# Altium schematic sheet Peripheral.SchDoc
size 420 x 297 mm; Scale: 1:1; DocumentType: Схема электрическая принципиальная; SheetNumber: 32; SheetTotal: 32; DocumentTypeShort: Э3; DocumentInvertoryNumber: ㅤ
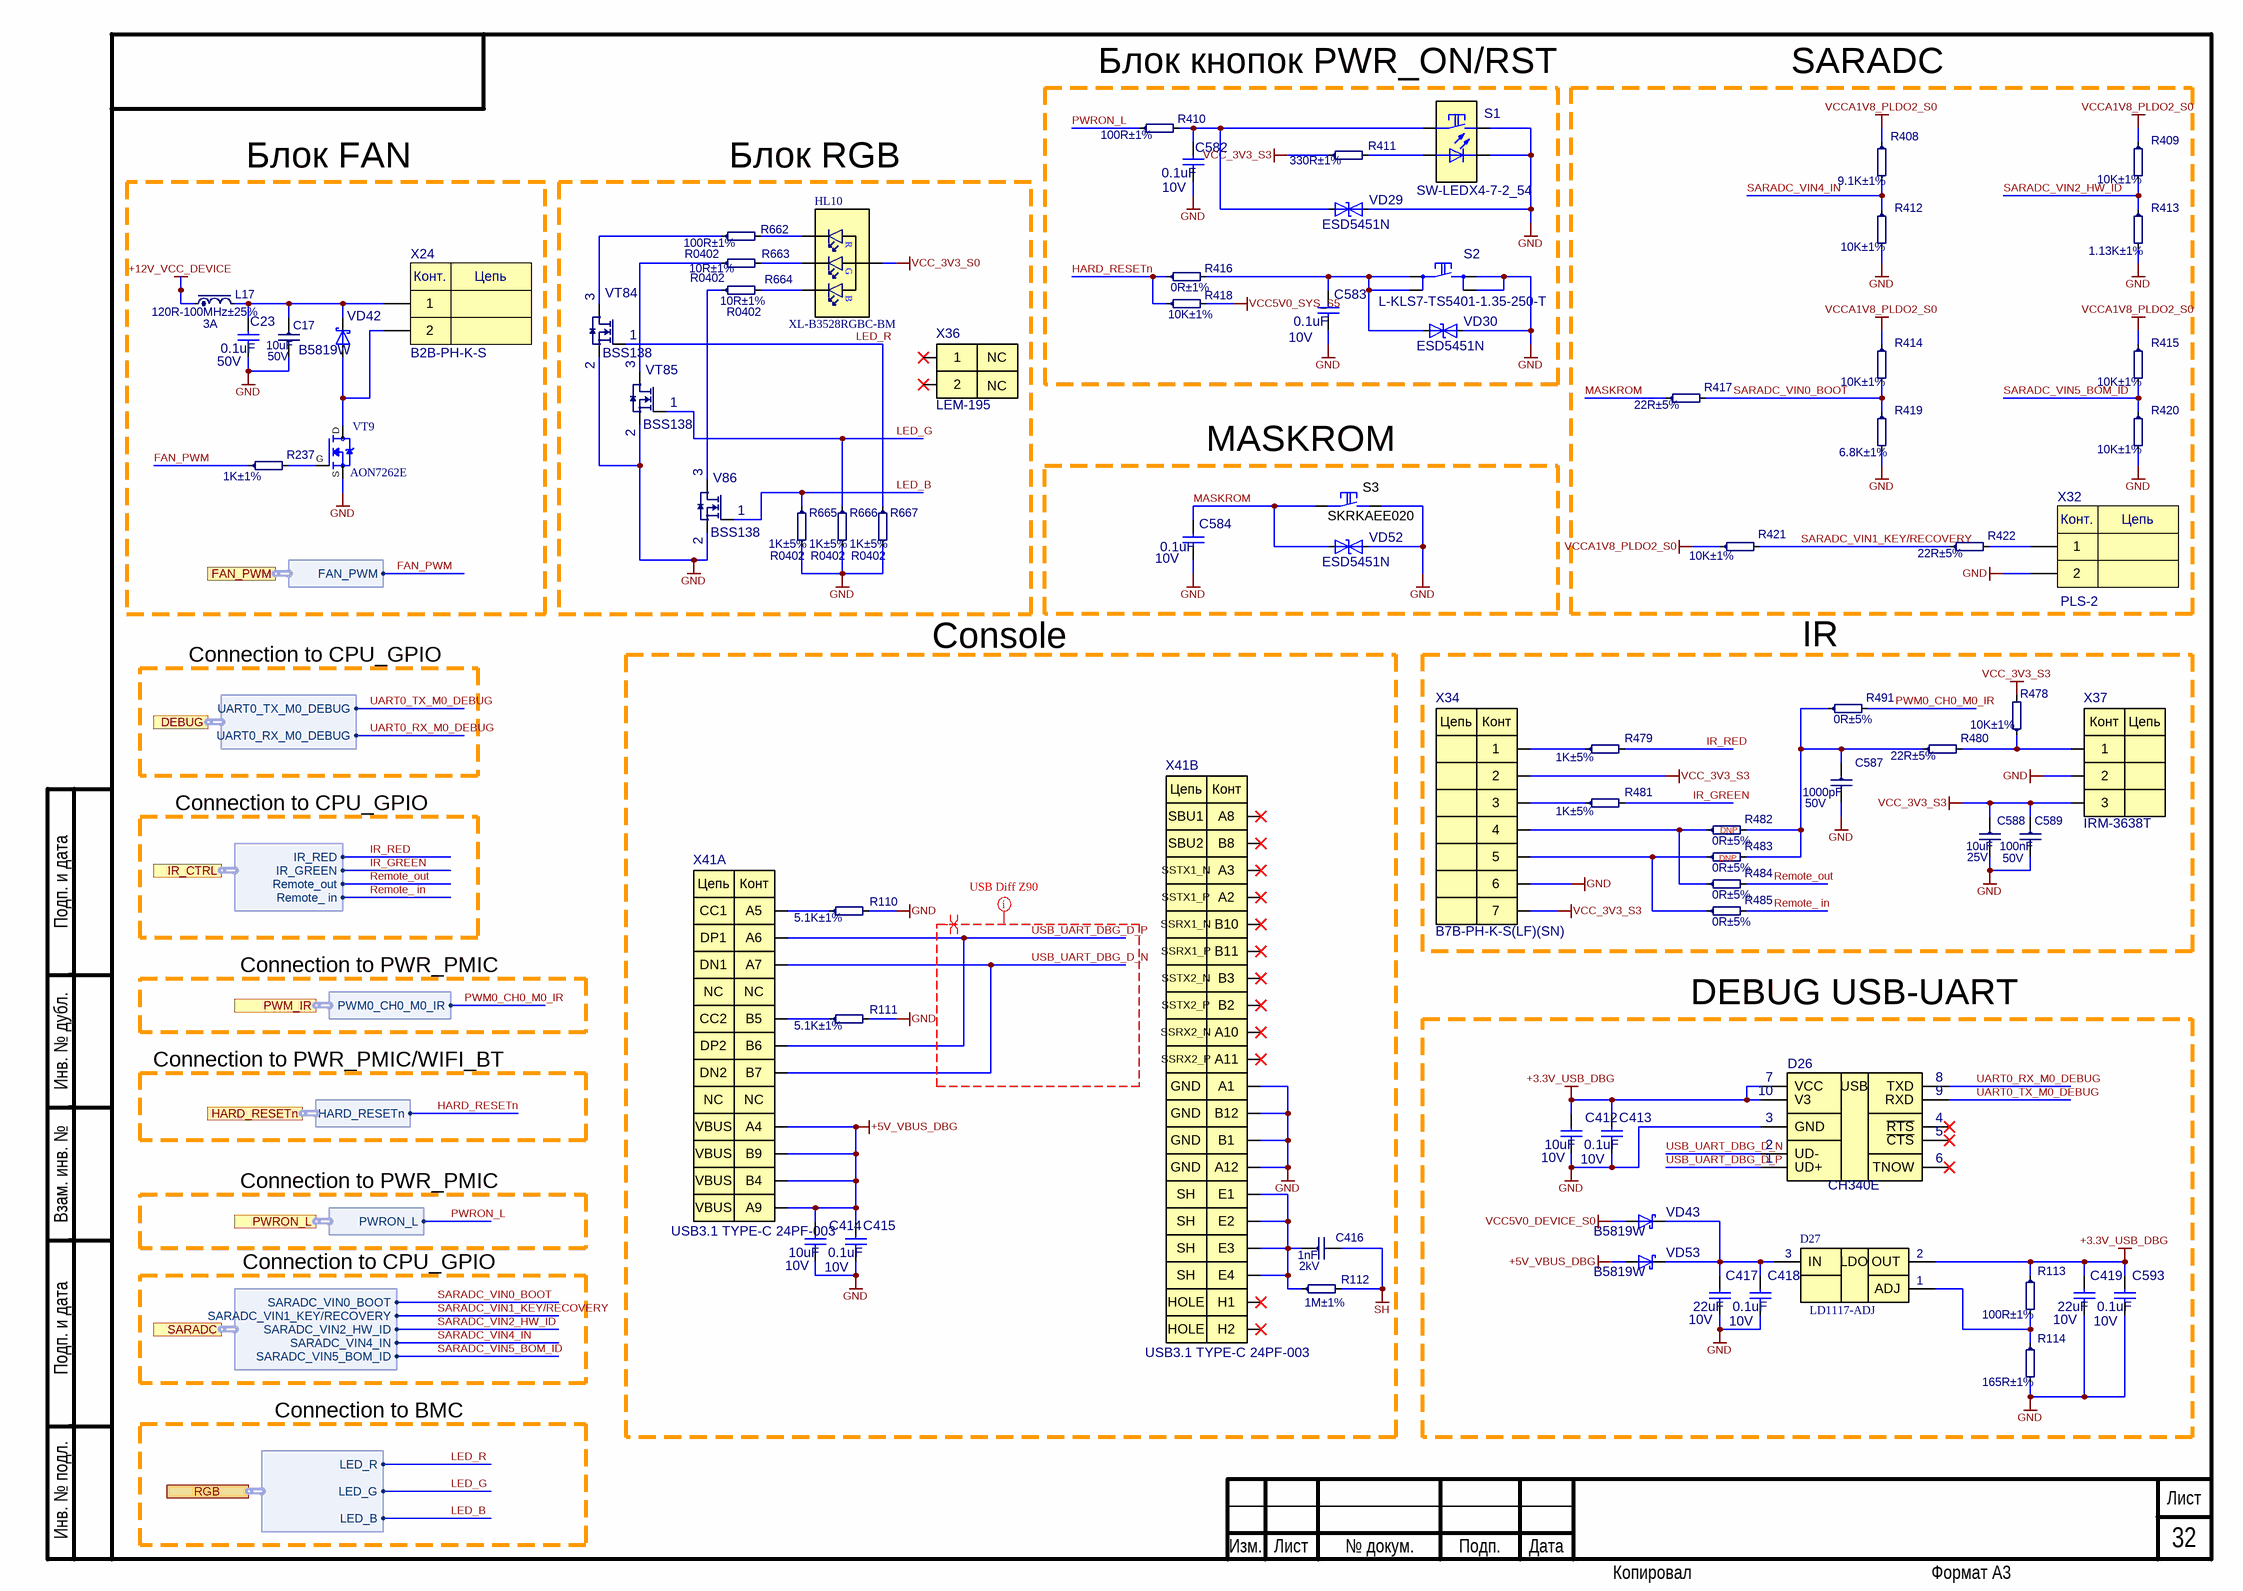
[diagram p0: Peripheral.SchDoc]

## Parts
C17  10uF  Voltage: 50V  [C1206]
C23  0.1uF  Voltage: 50V  [C0402]
C412  10uF  Voltage: 10V  [C0402]
C413  0.1uF  Voltage: 10V  [C0402]
C414  10uF  Voltage: 10V  [C0402]
C415  0.1uF  Voltage: 10V  [C0402]
C416  1nF  Voltage: 2kV  [C1812]
C417  22uF  Voltage: 10V  [C0603]
C418  0.1uF  Voltage: 10V  [C0402]
C419  22uF  Voltage: 10V  [C0603]
C582  0.1uF  Voltage: 10V  [C0402]
C583  0.1uF  Voltage: 10V  [C0402]
C584  0.1uF  Voltage: 10V  [C0402]
C587  1000pF  Voltage: 50V  [C0402]
C588  10uF  Voltage: 25V  [C0805]
C589  100nF  Voltage: 50V  [C0402]
C593  0.1uF  Voltage: 10V  [C0402]
D26  CH340E  [MSOP-10]
D27  LD1117-ADJ  [GM1117S-AST3R]
HL10  XL-B3528RGBC-BM  [XL-B3528RGBC-BM]
L17  120R-100MHz±25%  Current: 3A  [L0805]
R110  5.1K±1%  [R0402]
R111  5.1K±1%  [R0402]
R112  1M±1%  [R1206]
R113  100R±1%  [R0402]
R114  165R±1%  [R0402]
R237  1K±1%  [R0402]
R408  9.1K±1%  [R0402]
R409  10K±1%  [R0402]
R410  100R±1%  [R0402]
R411  330R±1%  [R0402]
R412  10K±1%  [R0402]
R413  1.13K±1%  [R0402]
R414  10K±1%  [R0402]
R415  10K±1%  [R0402]
R416  0R±1%  [R0402]
R417  22R±5%  [R0402]
R418  10K±1%  [R0402]
R419  6.8K±1%  [R0402]
R420  10K±1%  [R0402]
R421  10K±1%  [R0402]
R422  22R±5%  [R0402]
R478  10K±1%  [R0402]
R479  1K±5%  [R0402]
R480  22R±5%  [R0402]
R481  1K±5%  [R0402]
R482  0R±5%  [R0402]
R483  0R±5%  [R0402]
R484  0R±5%  [R0402]
R485  0R±5%  [R0402]
R491  0R±5%  [R0402]
R662  100R±1%  [R0402]
R663  10R±1%  [R0402]
R664  10R±1%  [R0402]
R665  1K±5%  [R0402]
R666  1K±5%  [R0402]
R667  1K±5%  [R0402]
S1  SW-LEDX4-7-2_54  [SW-LEDX4-7-2_54]
S2  L-KLS7-TS5401-1.35-250-T  [KLS7-TS5401]
S3  SKRKAEE020  [SKRKAEE020]
V86  BSS138  [SOT23]
VD29  ESD5451N  [DFN_1006_2]
VD30  ESD5451N  [DFN_1006_2]
VD42  B5819W  [B5819W]
VD43  B5819W  [B5819W]
VD52  ESD5451N  [DFN_1006_2]
VD53  B5819W  [B5819W]
VT9  AON7262E  [AON7262E]
VT84  BSS138  [SOT23]
VT85  BSS138  [SOT23]
X24  B2B-PH-K-S  [B2B-PH-K-S]
X32  PLS-2  [PLS2]
X34  B7B-PH-K-S(LF)(SN)  [B7B-PH-K-S(LF)(SN)]
X36  LEM-195  [LEM-195]
X37  IRM-3638T  [IRM-3638T]
X41  USB3.1 TYPE-C 24PF-003  [USB3.1 TYPE-C 24PF-003]  (parts A,B of 2)

## Blocks framed on the sheet
Console: C414-C416 R110-R112 X41

## Ports
DEBUG (harness DEBUG), FAN_PWM (harness FAN_PWM), HARD_RESETn (harness HARD_RESETn), IR_CTRL (harness IR_CTRL), PWM_IR (harness PWM0_IR), PWRON_L (harness PWRON_L), RGB (harness RGB), SARADC (harness SARADC)

## Harnesses
RGB: LED_G, LED_R, LED_B
PWRON_L: PWRON_L
SARADC: SARADC_VIN4_IN, SARADC_VIN2_HW_ID, SARADC_VIN1_KEY/RECOVERY, SARADC_VIN0_BOOT, SARADC_VIN5_BOM_ID
HARD_RESETn: HARD_RESETn
IR_CTRL: Remote_out, IR_GREEN, IR_RED, Remote_ in
PWM0_IR: PWM0_CH0_M0_IR
DEBUG: UART0_RX_M0_DEBUG, UART0_TX_M0_DEBUG
FAN_PWM: FAN_PWM

## Nets
+3.3V_USB_DBG: C412.2 C413.2 C419.2 C593.2 D26.7(VCC) D26.10(V3) D27.2(OUT) R113.1
+5V_VBUS_DBG: C414.2 C415.2 VD53.2(A) X41.A4(VBUS) X41.A9(VBUS) X41.B4(VBUS) X41.B9(VBUS)
+12V_VCC_DEVICE: L17.1
GND: C17.2 C23.1 C412.1 C413.1 C414.1 C415.1 C417.1 C418.1 C419.1 C582.1 C583.1 C584.1 C587.2 C588.2 C589.2 C593.1 D26.3(GND) R110.2 R111.2 R114.2 R412.2 R413.2 R419.2 R420.2 R665.2 R666.2 R667.2 S1.2 S1.L2(C) S2.3 S2.4 S3.2 V86.2(S) VD29.1 VD30.1 VD52.1 VT9.S VT84.2(S) VT85.2(S) X32.2 X34.6 X37.2 X41.A12(GND) X41.B1(GND) X41.B12(GND)
SH: C416.2 R112.2
VCC5V0_DEVICE_S0: VD43.2(A)
VCC5V0_SYS_S5: R418.2
VCC_3V3_S0: HL10.2
VCC_3V3_S3: C588.1 C589.1 R411.1 R478.2 X34.2 X34.7 X37.3
VCCA1V8_PLDO2_S0: R408.1 R409.1 R414.1 R415.1 R421.1
FAN_PWM: R237.1 ; port FAN_PWM.FAN_PWM
HARD_RESETn: R416.1 R418.1 ; port HARD_RESETn.HARD_RESETn
IR_GREEN: R481.2 ; port IR_CTRL.IR_GREEN
IR_RED: R479.2 ; port IR_CTRL.IR_RED
LED_B: R665.1 V86.1(G) ; port RGB.LED_B
LED_G: R666.1 VT85.1(G) ; port RGB.LED_G
LED_R: R667.1 VT84.1(G) ; port RGB.LED_R
MASKROM: C584.2 R417.1 S3.1 VD52.2
PWM0_CH0_M0_IR: R491.2 ; port PWM_IR.PWM0_CH0_M0_IR
PWRON_L: R410.1 ; port PWRON_L.PWRON_L
Remote_ in: R485.2 ; port IR_CTRL.Remote_ in
Remote_out: R484.2 ; port IR_CTRL.Remote_out
SARADC_VIN0_BOOT: R414.2 R417.2 R419.1 ; port SARADC.SARADC_VIN0_BOOT
SARADC_VIN1_KEY/RECOVERY: R421.2 R422.1 ; port SARADC.SARADC_VIN1_KEY/RECOVERY
SARADC_VIN2_HW_ID: R409.2 R413.1 ; port SARADC.SARADC_VIN2_HW_ID
SARADC_VIN4_IN: R408.2 R412.1 ; port SARADC.SARADC_VIN4_IN
SARADC_VIN5_BOM_ID: R415.2 R420.1 ; port SARADC.SARADC_VIN5_BOM_ID
UART0_RX_M0_DEBUG: D26.8(TXD) ; port DEBUG.UART0_RX_M0_DEBUG
UART0_TX_M0_DEBUG: D26.9(RXD) ; port DEBUG.UART0_TX_M0_DEBUG
USB_UART_DBG_D_N: D26.2(UD-) X41.A7(DN1) X41.B7(DN2)
USB_UART_DBG_D_P: D26.1(UD+) X41.A6(DP1) X41.B6(DP2)
NetC17_1: C17.1 C23.2 L17.2 VD42.1(K) X24.1
NetC416_1: C416.1 R112.1 X41.E1(SH) X41.E2(SH) X41.E3(SH) X41.E4(SH)
NetC417_2: C417.2 C418.2 D27.3(IN) VD43.1(K) VD53.1(K)
NetC582_2: C582.2 R410.2 S1.1 VD29.2
NetC583_2: C583.2 R416.2 S2.1 S2.2 VD30.2
NetC587_1: C587.1 R480.1 R482.2 R483.2 R491.1
NetD27_1: D27.1(ADJ) R113.2 R114.1
NetHL10_1: HL10.1 R662.2
NetHL10_3: HL10.3 R663.2
NetHL10_4: HL10.4 R664.2
NetR110_1: R110.1 X41.A5(CC1)
NetR111_1: R111.1 X41.B5(CC2)
NetR237_2: R237.2 VT9.G
NetR411_2: R411.2 S1.L1(A)
NetR422_2: R422.2 X32.1
NetR478_1: R478.1 R480.2 X37.1
NetR479_1: R479.1 X34.1
NetR481_1: R481.1 X34.3
NetR482_1: R482.1 R484.1 X34.4
NetR483_1: R483.1 R485.1 X34.5
NetR662_1: R662.1 VT84.3(D)
NetR663_1: R663.1 VT85.3(D)
NetR664_1: R664.1 V86.3(D)
NetVD42_2: VD42.2(A) VT9.D X24.2

Not connected (* = marked no-connect by the designer): D26 4(~{RTS})* 5(~{CTS})* 6(TNOW)*; X36 1* 2*; X41 A2(SSTX1_P)* A3(SSTX1_N)* A8(SBU1)* A10(SSRX2_N)* A11(SSRX2_P)* B2(SSTX2_P)* B3(SSTX2_N)* B8(SBU2)* B10(SSRX1_N)* B11(SSRX1_P)* H1(GND)* H2(GND)*

## Layout directives
net class USB: USB_UART_DBG_D_N, USB_UART_DBG_D_P
differential pair; differential pair class Diff_Z90: USB_UART_DBG_D_N, USB_UART_DBG_D_P

## Notes on the sheet
- Блок кнопок PWR_ON/RST
- SARADC
- Блок FAN
- Блок RGB
- (near S3) MASKROM
- Connection to CPU_GPIO
- IR
- (near R483) DNP
- (near R482) DNP
- Connection to PWR_PMIC
- DEBUG USB-UART
- Connection to PWR_PMIC/WIFI_BT
- Connection to BMC
- Подп. и дата
- Инв. № дубл.
- Взам. инв. №
- Инв. № подл.
- Изм.
- Лист
- № докум.
- Подп.
- Дата
- Копировал
- Формат А3
- (in symbol B2B-PH-K-S) Конт.; Цепь
- (in symbol B7B-PH-K-S(LF)(SN)) Цепь; Конт
- (in symbol CH340E) USB
- (in symbol GM1117S-AST3R) LDO
- (in symbol IRM-3638T) Конт; Цепь
- (in symbol LEM-195) NC
- (in symbol PLS-2) Конт.; Цепь
- (in symbol USB3.1 TYPE-C 24PF-003, part A) Цепь; Конт; NC
- (in symbol USB3.1 TYPE-C 24PF-003, part B) Цепь; Конт; A1; HOLE
- (in symbol XL-B3528RGBC-BM) R; G; B

## Library data of the parts
C17 = 1206-X5R-50V-010uF±10%: Manufacturer: Yageo; NameFromManufacturer: CC1206KKX5R9BB106; Dielectric: X5R; Place: *); Tolerance: 10%; Check: False; Case: C1206; Part Number: 1206-X5R-50V-010uF±10%; Value: 10uF; Temperature: -55°C~85°C; ComponentLink2Description: Link to datasheet; ComponentLink1Description: DATASHEET; ComponentLink2URL: https://www.terraelectronica.ru/product/2097656; ComponentLink1URL: Datasheets/capacitors/UPY-GPHC_X5R_4V-to-50V_27.pdf; Last changed: 27.10.2022
C23 = 0402-X5R-50V-0.1uF±10%: Manufacturer: Yageo; NameFromManufacturer: CC0402KRX5R9BB104; Place: S; Tolerance: 10%; Check: False; Part Number: 0402-X5R-50V-0.1uF±10%; Value: 0.1uF; Temperature: -55°C~85°C; ComponentLink2Description: Link to datasheet; ComponentLink1Description: DATASHEET; ComponentLink2URL: https://www.yageo.com/upload/media/product/productsearch/datasheet/mlcc/UPY-GPHC_X5R_4V-to-50V_26.pdf; ComponentLink1URL: Datasheets/capacitors/UPY-GPHC_X5R_4V-to-50V_26.pdf; Last changed: 27.10.2022
C412 C414 = 0402-X5R-10V-10uF±20%: *; Manufacturer: Murata Electronics; NameFromManufacturer: GRM155R61A106ME44; Place: S; Tolerance: 20%; Check: False; Part Number: 0402-X5R-10V-10uF±20%; Value: 10uF; Temperature: -55°C~85°C; ComponentLink2Description: Link to datasheet; ComponentLink1Description: DATASHEET; ComponentLink2URL: https://octopart.com/grm155r61a106me44d-murata-99357754?r=sp; ComponentLink1URL: Datasheets/capacitors/GRM155R61A106ME44D.pdf; Last changed: 27.10.2022
C413 C415 C418 C582-C584 C593 = 0402-X7R-16V-0.1uF±10%: Part Number: 0402-X5R-10V-0.1uF±10%; Manufacturer: Yageo; NameFromManufacturer: CC0402KRX5R6BB104; Place: S; Tolerance: 10%; Check: False; Value: 0.1uF; Temperature: -55°C~125°C; ComponentLink2Description: Link to datasheet; ComponentLink1Description: DATASHEET; Last changed: 27.10.2022
C416 = 1812-C0G-2kV-1uF±10%: *; Part Number: 1812-C0G-2kV-1nF±10%; Manufacturer: FH; NameFromManufacturer: 1812B102K202NT; Dielectric: C0G; Place: *); Tolerance: 5%; Check: False; Case: CASE; Value: 1nF; Temperature: -55°C~125°C; ComponentLink2Description: Link to datasheet; ComponentLink1Description: DATASHEET; ComponentLink2URL: https://octopart.com/1812ga102jat2a-avx-75165070?r=sp; ComponentLink1URL: Datasheets/capacitors/C0GNP0-Dielectric.pdf; Last changed: 27.10.2022
C417 C419 = 0603-X5R-10V-22uF±20%: *; Manufacturer: Murata; NameFromManufacturer: GRM188R61A226ME15D; Place: S; Tolerance: 20%; Part Number: 0603-X5R-10V-22uF±20%; Value: 22uF; Temperature: -55°C~85°C; ComponentLink2Description: Link to datasheet; ComponentLink1Description: DATASHEET
C587 = 0402-NP0-50V-1000pF±5%: Manufacturer: Yageo; NameFromManufacturer: CC0402JRNPO9BN102; Dielectric: NP0; Place: *); Tolerance: 5%; Check: False; Case: C0402; Part Number: 0402-NP0-50V-1000pF±5%; Value: 1000pF; Temperature: -55°C~125°C; ComponentLink2Description: Link to datasheet; ComponentLink1Description: DATASHEET; ComponentLink2URL: https://www.terraelectronica.ru/product/2101763; ComponentLink1URL: Datasheets/capacitors/UPY-GP_NP0_16V-to-50V_18.pdf; Last changed: 27.10.2022
C588 = 0805-X5R-25V-10uF±10%: Manufacturer: Samsung; NameFromManufacturer: CL21A106KAYNNNE; Dielectric: X5R; Place: *); Tolerance: 10%; Check: False; Case: C0805; Part Number: 0805-X5R-25V-10uF±10%; Value: 10uF; Temperature: -55°C~85°C; ComponentLink2Description: Link to datasheet; ComponentLink1Description: DATASHEET; ComponentLink2URL: https://www.terraelectronica.ru/product/1640984; ComponentLink1URL: Datasheets/capacitors/MLCC-1837944.pdf; Last changed: 27.10.2022
C589 = 0402-X7R-50V-0.1uF±10%: Ceramic Capacitor 0402 100nF ±10% 50V X7R; Manufacturer: Yageo; NameFromManufacturer: CC0402KRX7R9BB104; Place: *); Check: False; Dielectric: X7R; Case: C0402; Part Number: 0402-X7R-50V-0.1uF±10%; Value: 100nF; Tolerance: 10%; Temperature: -55°C~125°C; ComponentLink2Description: Link to datasheet; ComponentLink1Description: DATASHEET; ComponentLink2URL: https://www.lcsc.com/product-detail/Multilayer-Ceramic-Capacitors-MLCC-SMD-SMT_YAGEO-CC0402KRX7R9BB104_C131394.html; Last changed: 09.04.2025
D26 = CH340E: USB to serial chip; Manufacturer: WCH; Place: S; Check: False; Part Number: CH340E; Value: CH340E; ComponentLink1Description: DATASHEET; NameFromManufacturer: CH340E; Datasheet: Datasheets/ic/35227cpdata.pdf; Last changed: 27.10.2022
D27 = GM1117S-AST3R: Manufacturer: UMW; Check: False; Part Number: LD1117-ADJ; NameFromManufacturer: LD1117-ADJ; Value: LD1117-ADJ; Analog: GM1117S-AST3R
HL10 = XL-B3528RGBC-BM: 20mA 无色透明透镜 -40℃~+85℃ Common anode 正贴 RGB 45mW SMD2835-4P Light Emitting Diodes (LED) ROHS; Manufacturer: XINGLIGHT; Check: False; Part Number: XL-B3528RGBC-BM; NameFromManufacturer: XL-B3528RGBC-BM; Value: XL-B3528RGBC-BM
L17 = 0805-3A-120R-100MHz: *; Manufacturer: Murata Electronics; NameFromManufacturer: BLM21PG121SH1D; Place: *); Tolerance: 25%; DC Resistance: 0.03R; Check: False; Case: L0805; Part Number: 0805-3A-120R-100MHz; Value: 120R-100MHz; Temperature: -55°C~125°C; ComponentLink1Description: DATASHEET; ComponentLink1URL: https://www.terraelectronica.ru/product/854541; Datasheet: Datasheets/inductors/QNFA9102.pdf; Last changed: 27.10.2022
R110 R111 = 0402-0.0625W-5.1K-100ppm±1%: Chip Resistor 0402 5.1kΩ ±1% 50V ±100ppm/℃ Thick Film; NameFromManufacturer: RC0402FR-075K1L; Manufacturer: Yageo; Place: *); Value: 5.1K; Check: False; Case: R0402; Part Number: 0402-0.0625W-5.1K-100ppm±1%; Tolerance: 1%; Temperature: -55°C~155°C; ComponentLink1Description: DATASHEET; ComponentLink1URL: https://www.yageo.com/upload/media/product/productsearch/datasheet/rchip/PYu-RC_Group_51_RoHS_L_11.pdf; Datasheet: Datasheets/resistors/PYu-RC_Group_51_RoHS_L_11.pdf; Last changed: 27.10.2022
R112 = 1206-0.25W-1M-100ppm±1%: Chip Resistor 1206 1MΩ ±1% 200V ±100ppm/℃ Thick Film; NameFromManufacturer: RC1206FR-071ML; Manufacturer: Yageo; Place: *); Value: 1M; Check: False; Case: R1206; Part Number: 1206-0.25W-1M-100ppm±1%; Tolerance: 1%; Temperature: -55°C~155°C; ComponentLink1Description: DATASHEET; ComponentLink1URL: https://www.lcsc.com/product-detail/Chip-Resistor-Surface-Mount_YAGEO-RC1206FR-071ML_C108083.html?s_z=n_RC1206FR-071ML; Last changed: 09.04.2025
R113 R410 R662 = 0402-0.0625W-100R-100ppm±1%: Chip Resistor 0402 100Ω ±1% 50V ±100ppm/℃ Thick Film; NameFromManufacturer: RC0402FR-07100RL; Manufacturer: Yageo; Place: *); Value: 100R; Check: False; Case: R0402; Part Number: 0402-0.0625W-100R-100ppm±1%; Tolerance: 1%; Temperature: -55°C~155°C; ComponentLink1Description: DATASHEET; ComponentLink1URL: https://www.yageo.com/upload/media/product/productsearch/datasheet/rchip/PYu-RC_Group_51_RoHS_L_11.pdf; Datasheet: Datasheets/resistors/PYu-RC_Group_51_RoHS_L_11.pdf; Last changed: 27.10.2022
R114 = 0402-0.0625W-100R-100ppm±1%: Chip Resistor 0402 100Ω ±1% 50V ±100ppm/℃ Thick Film; Part Number: 0402-0.0625W-165R-100ppm±1%; NameFromManufacturer: AC0402FR-07165RL; Manufacturer: Yageo; Place: *); Value: 165R; Check: False; Case: R0402; Tolerance: 1%; Temperature: -55°C~155°C; ComponentLink1Description: DATASHEET; ComponentLink1URL: https://www.yageo.com/upload/media/product/productsearch/datasheet/rchip/PYu-RC_Group_51_RoHS_L_11.pdf; Datasheet: Datasheets/resistors/PYu-RC_Group_51_RoHS_L_11.pdf; Last changed: 27.10.2022
R237 = 0402-0.0625W-1K-100ppm±1%: NameFromManufacturer: RC0402FR-071KL; Manufacturer: Yageo; Place: *); Value: 1K; Tolerance: 1%; Check: False; Case: R0402; Part Number: 0402-0.0625W-1K-100ppm±1%; Temperature: -55°C~155°C; ComponentLink1Description: DATASHEET; ComponentLink1URL: https://ru.mouser.com/datasheet/2/447/PYu_RC_Group_51_RoHS_L_10-1664068.pdf; Datasheet: Datasheets/resistors/PYu_RC_Group_51_RoHS_L_10-1664068.pdf; Last changed: 27.10.2022
R408 = 0402-0.0625W-9.1K-100ppm±1%: NameFromManufacturer: RC0402FR-079K1L; Manufacturer: Yageo; Place: *); Value: 9.1K; Tolerance: 1%; Check: False; Case: R0402; Part Number: 0402-0.0625W-9.1K-100ppm±1%; Temperature: -55°C~155°C; ComponentLink1Description: DATASHEET; ComponentLink1URL: digikey.com/en/products/detail/yageo/RC0402FR-079K1L/726668; Datasheet: Datasheets/resistors/PYu-RC_Group_51_RoHS_L_12.pdf; Last changed: 27.10.2022
R409 R412 R414 R415 R418 R420 R421 R478 = 0402-0.0625W-10K-100ppm±1%: Chip Resistor 0402 10kΩ ±1% 50V ±100ppm/℃ Thick Film; NameFromManufacturer: RC0402FR-0710KL; Manufacturer: Yageo; Place: *); Value: 10K; Check: False; Case: R0402; Part Number: 0402-0.0625W-10K-100ppm±1%; Tolerance: 1%; Temperature: -55°C~155°C; ComponentLink1Description: DATASHEET; ComponentLink1URL: https://ru.mouser.com/ProductDetail/YAGEO/RC0402FR-0710KL?qs=%2Fha2pyFaduhjtLcYvKXQ8IogF7YwN7YtH%252BOO8ZtEEMnoa4yoWYcwpw%3D%3D; Datasheet: Datasheets/resistors/PYu-RC_Group_51_RoHS_L_11.pdf; Last changed: 27.10.2022
R411 = 0402-0.0625W-330R-100ppm±1%: NameFromManufacturer: AC0402FR-07330RL; Manufacturer: Yageo; Place: *); Value: 330R; Tolerance: 1%; Check: False; Case: R0402; Part Number: 0402-0.0625W-330R-100ppm±1%; Temperature: -55°C~155°C; ComponentLink1Description: DATASHEET; ComponentLink1URL: https://www.yageo.com/upload/media/product/productsearch/datasheet/rchip/PYu-AC_51_RoHS_L_7.pdf; Datasheet: Datasheets/resistors/PYu-AC_51_RoHS_L_9.pdf; Last changed: 27.10.2022
R413 = 0402-0.0625W-10K-100ppm±1%: Chip Resistor 0402 10kΩ ±1% 50V ±100ppm/℃ Thick Film; Part Number: 0402-0.0625W-1.13K-100ppm±1%; NameFromManufacturer: RC0402FR-071K13L; Manufacturer: Yageo; Place: *); Value: 1.13K; Check: False; Case: R0402; Tolerance: 1%; Temperature: -55°C~155°C; ComponentLink1Description: DATASHEET; ComponentLink1URL: https://ru.mouser.com/ProductDetail/YAGEO/RC0402FR-0710KL?qs=%2Fha2pyFaduhjtLcYvKXQ8IogF7YwN7YtH%252BOO8ZtEEMnoa4yoWYcwpw%3D%3D; Datasheet: Datasheets/resistors/PYu-RC_Group_51_RoHS_L_11.pdf; Last changed: 27.10.2022
R416 = 0402-0.0625W-0R-100ppm±1%: Chip Resistor 0402 0Ω ±1% 50V ±100ppm/℃ Thick Film; NameFromManufacturer: RC0402FR-070RL; Manufacturer: Yageo; Place: *); Value: 0R; Check: False; Case: R0402; Part Number: 0402-0.0625W-0R-100ppm±1%; Tolerance: 1%; Temperature: -55°C~155°C; ComponentLink1Description: DATASHEET; ComponentLink1URL: https://www.chipdip.ru/product0/8000617426?ysclid=l7og5x0plo427794326; Datasheet: Datasheets/resistors/DOC012445956.pdf; Last changed: 27.10.2022
R417 R422 R480 = 0402-0.0625W-22R-100ppm±5%: NameFromManufacturer: RC0402JR-0722RL; Manufacturer: Yageo; Place: *); Value: 22R; Tolerance: 5%; Check: False; Case: R0402; Part Number: 0402-0.0625W-22R-100ppm±5%; Temperature: -55°C~155°C; ComponentLink1Description: DATASHEET; ComponentLink1URL: https://www.terraelectronica.ru/pdf/show?pdf_file=%252Fds%252Fpdf%252FR%252FRC0402.pdf; Datasheet: Datasheets/resistors/PYu-RC_Group_51_RoHS_L_12.pdf; Last changed: 27.10.2022
R419 = 0402-0.0625W-6.8K-100ppm±1%: NameFromManufacturer: RC0402FR-076K8L; Manufacturer: Yageo; Place: *); Value: 6.8K; Tolerance: 1%; Check: False; Case: R0402; Part Number: 0402-0.0625W-6.8K-100ppm±1%; Temperature: -55°C~155°C; ComponentLink1Description: DATASHEET; ComponentLink1URL: https://www.terraelectronica.ru/product/538831; Datasheet: Datasheets/resistors/PYu-RC_Group_51_RoHS_L_12.pdf; Last changed: 27.10.2022
R479 R481 R665-R667 = 0402-0.0625W-1K-100ppm±5%: NameFromManufacturer: RC0402JR-071KL; Manufacturer: Yageo; Place: *); Value: 1K; Tolerance: 5%; Check: False; Case: R0402; Part Number: 0402-0.0625W-1K-100ppm±5%; Temperature: -55°C~155°C; ComponentLink1Description: DATASHEET; ComponentLink1URL: https://ru.mouser.com/ProductDetail/YAGEO/RC0402JR-071KL?qs=%2Fha2pyFadugNN0LzwXn2qBG%2Fxv0pCy6gh7Z%252B1hZJT2CnjLeHVORGDQ%3D%3D; Datasheet: Datasheets/resistors/PYu-RC_Group_51_RoHS_L_11.pdf; Last changed: 27.10.2022
R482-R485 R491 = 0402-0.0625W-0R-100ppm±5%: NameFromManufacturer: RC0402JR-070RL; Manufacturer: Yageo; Place: *); Value: 0R; Tolerance: 5%; Check: False; Case: R0402; Part Number: 0402-0.0625W-0R-100ppm±5%; Temperature: -55°C~155°C; ComponentLink1Description: DATASHEET; ComponentLink1URL: https://ru.mouser.com/ProductDetail/YAGEO/RC0402JR-070RL?qs=%2Fha2pyFadugNN0LzwXn2qP7HsQ9BBU71VWxeSOFlFaYv9aVJHghTrg%3D%3D; Datasheet: Datasheets/resistors/PYu-RC_Group_51_RoHS_L_11.pdf; Last changed: 27.10.2022
R663 R664 = 0402-0.0625W-10R-200ppm±1%: NameFromManufacturer: RC0402FR-0710RL; Manufacturer: Yageo; Place: *); Value: 10R; Tolerance: 1%; Check: False; Case: R0402; Part Number: 0402-0.0625W-10R-200ppm±1%; Temperature: -55°C~155°C; ComponentLink1Description: DATASHEET; ComponentLink1URL: https://www.compel.ru/infosheet/YAG/RC0402FR-0710RL; Datasheet: Datasheets/resistors/PYu-RC_Group_51_RoHS_L_11.pdf; Last changed: 27.10.2022
S1 = SW-LEDX4-7-2_54: Manufacturer: FVWIN Electronics; Check: False; Part Number: SW-LEDX4-7-2_54; Value: SW-LEDX4-7-2_54; NameFromManufacturer: SW-LEDX4-7-2_54
S2 = L-KLS7-TS5401-1.35-250-T: Switch; Manufacturer: KLS Electronic; Place: T; Check: False; Part Number: L-KLS7-TS5401-1.35-250-T; Value: L-KLS7-TS5401-1.35-250-T; Temperature: -30°C~70°C; ComponentLink1URL: https://www.chipdip.ru/product0/8010518403; ComponentLink1Description: DATASHEET; NameFromManufacturer: L-KLS7-TS5401-1.35-250-T; Datasheet: Datasheets/switch/20150508141012KLS7-TS5401.pdf; Last changed: 27.10.2022
S3 = SKRKAEE020: 12V 2.9mm Round Button 3.9mm SPST 50mA SMD,3.9x2.9mm Tactile Switches RoHS; Manufacturer: ALPSALPINE; Check: False; Part Number: SKRKAEE020; Value: SKRKAEE020; NameFromManufacturer: SKRKAEE020
V86 VT84 VT85 = BSS138: N-Channel Enhancement Mode Field Effect Transistor; Manufacturer: Yangjie; Place: *); Voltage: 50V; Check: False; Part Number: BSS138; Value: BSS138; Temperature: -55°C~150°C; ComponentLink1Description: DATASHEET; NameFromManufacturer: BSS138; ComponentLink1URL: https://www.electronshik.ru/item/YJ/BSS138; Datasheet: Datasheets/transistors/BSS138.pdf; Last changeв: 27.10.2022
VD29 VD30 VD52 = ESD5451N: Diode; Manufacturer: Tech Public Co.; Place: S; Check: False; Part Number: ESD5451N; Value: ESD5451N; Temperature: -65°C~150°C; ComponentLink1Description: DATASHEET; NameFromManufacturer: ESD5451N; Last changed: 13.04.2023
VD42 VD43 VD53 = B5819W: Manufacturer: MDD; Check: False; Part Number: B5819W; Value: B5819W; NameFromManufacturer: B5819W
VT9 = AON7262E: 60V 6.2mΩ@10V,20A 2.2V@250uA N Channel DFN-8(3.3x3.3) MOSFET; Manufacturer: Alpha & Omega; Check: False; Part Number: AON7262E; NameFromManufacturer: AON7262E; Value: AON7262E
X24 = B2B-PH-K-S: 1x2P PH 2mm Connector; Manufacturer: JST Sales America Inc.; Place: *); Check: False; Part Number: B2B-PH-K-S; Value: B2B-PH-K-S; Temperature: -25°C~85°C; ComponentLink1Description: DATASHEET; NameFromManufacturer: B2B-PH-K-S; ComponentLink1URL: https://www.lcsc.com/product-detail/Wire-To-Board-Wire-To-Wire-Connector_JST-B2B-PH-K-S-LF-SN_C131337.html; Last changed: 05.02.2024
X32 = PLS-2: Terminal block 2; Place: *); Check: False; Part Number: PLS-2; Value: PLS-2; Temperature: -25°C~85°C; ComponentLink1Description: DATASHEET; NameFromManufacturer: PLS-2; Datasheet: Datasheets/connectors/pld_pls_01.pdf; Last changed: 27.10.2022
X34 = B7B-PH-K-S(LF)(SN): Connector Header 7 position 2mm Pitch 2A Through Hole -25℃~+85℃; Manufacturer: JST; Check: False; Part Number: B7B-PH-K-S(LF)(SN); Value: B7B-PH-K-S(LF)(SN); NameFromManufacturer: B7B-PH-K-S(LF)(SN)
X36 = LEM-195: Manufacturer: Kang Yang; Check: False; Part Number: LEM-195; Value: LEM-195; NameFromManufacturer: LEM-195
X37 = IRM-3638T: SIP-3-2.54mm Photo Detectors - Remote Receiver RoHS; Manufacturer: EVERLIGHT; Check: False; Part Number: IRM-3638T; Value: IRM-3638T; NameFromManufacturer: IRM-3638T
X41 = USB3.1 TYPE-C 24PF-003: Разъем USB USB3.1 TYPE-C 24PF-003, 24 контакта; Manufacturer: RUICHI; Check: False; Package: None; Availability: Unavailable; Value: USB3.1 TYPE-C 24PF-003; MP: USB3.1 TYPE-C 24PF-003; Price: None; Part Number: USB3.1 TYPE-C 24PF-003; NameFromManufacturer: USB3.1 TYPE-C 24PF-003